# Altium schematic sheet Clock_management.SchDoc: AMC FMC Carrier v4
size 420 x 297 mm; CompanyName: WUT; Organization: WUT ISE; Address1: Warsaw University of Technology; Address2: Nowowiejska 15/19 00-665 Warsaw; Address3: t.przywozki@gmail.com; Revision: 1; SheetNumber: 22; SheetTotal: 29; Project: AMC FMC Carrier v4.0.2; ModifiedBy: M. Biernat; CheckedDate: -; Title2: Clock Management; DivGrp: ISE; Designer: T. Przywozki; ModifiedDate: -; ProjectName: ADC/DAC MEZZANINE
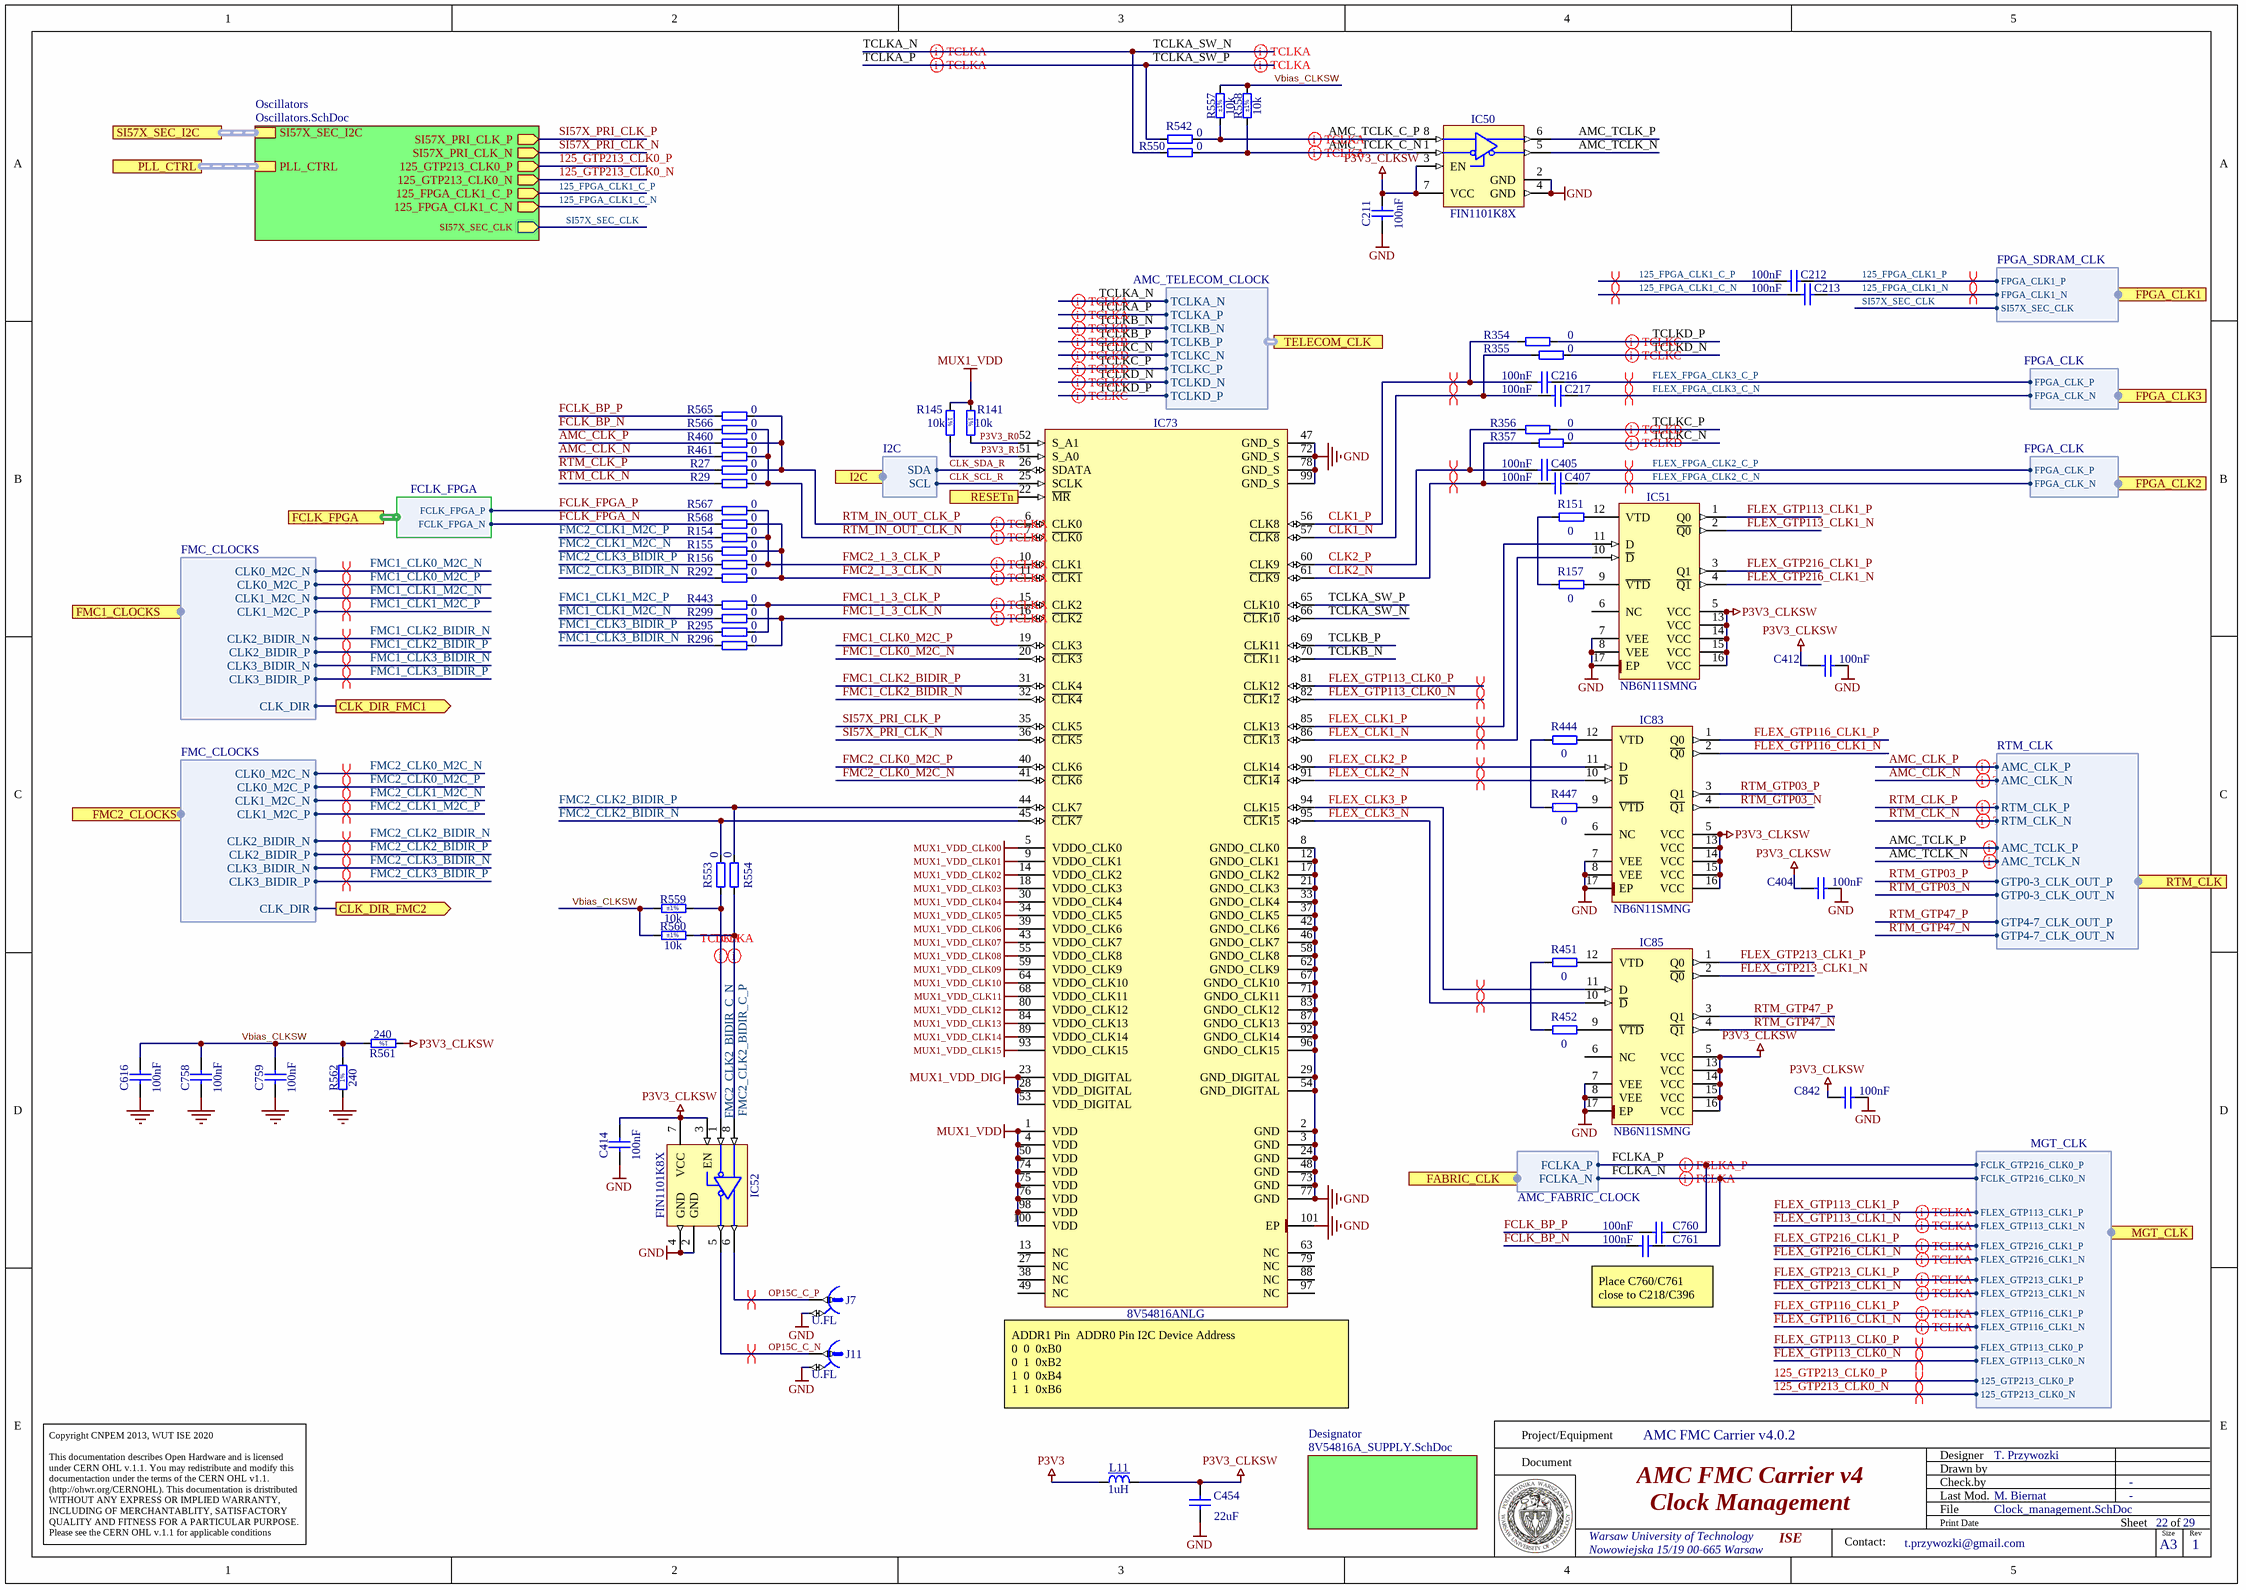
[diagram p0: Clock_management.SchDoc]

## Parts
C211  100nF  [CAPC1005X55N]
C212  100nF  [CAPC0603X33N]
C213  100nF  [CAPC0603X33N]
C216  100nF  [CAPC0603X33N]
C217  100nF  [CAPC0603X33N]
C404  100nF  [CAPC0603X33N]
C405  100nF  [CAPC0603X33N]
C407  100nF  [CAPC0603X33N]
C412  100nF  [CAPC0603X33N]
C414  100nF  [CAPC1005X55N]
C454  22uF  [CAPC3216X180N]
C616  100nF  [CAPC1005X55N]
C758  100nF  [CAPC1005X55N]
C759  100nF  [CAPC1005X55N]
C760  100nF  [CAPC0603X33N]
C761  100nF  [CAPC0603X33N]
C842  100nF  [CAPC0603X33N]
IC50  FIN1101K8X  [SOP50P310X90-8N]
IC51  NB6N11SMNG  [QFN50P300X300X100-17N-S185]
IC52  FIN1101K8X  [SOP50P310X90-8N]
IC73  8V54816ANLG  [QFN40P1200X1200X90-101N-S690]
IC83  NB6N11SMNG  [QFN50P300X300X100-17N-S185]
IC85  NB6N11SMNG  [QFN50P300X300X100-17N-S185]
J7  U.FL  [HIROSE_U.FL-R-SMT-1(10)]
J11  U.FL  [HIROSE_U.FL-R-SMT-1(10)]
L11  1uH  [IND_PANASONIC_ELLVGG]
R27  0  [RESC1005X40N]
R29  0  [RESC1005X40N]
R141  10k  [RESC1005X40N]
R145  10k  [RESC1005X40N]
R151  0  [RESC1005X40N]
R154  0  [RESC1005X40N]
R155  0  [RESC1005X40N]
R156  0  [RESC1005X40N]
R157  0  [RESC1005X40N]
R292  0  [RESC1005X40N]
R295  0  [RESC1005X40N]
R296  0  [RESC1005X40N]
R299  0  [RESC1005X40N]
R354  0  [RESC0603X28N]
R355  0  [RESC0603X28N]
R356  0  [RESC0603X28N]
R357  0  [RESC0603X28N]
R443  0  [RESC1005X40N]
R444  0  [RESC1005X40N]
R447  0  [RESC1005X40N]
R451  0  [RESC1005X40N]
R452  0  [RESC1005X40N]
R460  0  [RESC1005X40N]
R461  0  [RESC1005X40N]
R542  0  [RESC1005X40N]
R550  0  [RESC1005X40N]
R553  0  [RESC1005X40N]
R554  0  [RESC1005X40N]
R557  10k  Tolerance: ±1%  [RESC1005X40N]
R558  10k  Tolerance: ±1%  [RESC1005X40N]
R559  10k  Tolerance: ±1%  [RESC1005X40N]
R560  10k  Tolerance: ±1%  [RESC1005X40N]
R561  240  [RESC1005X40N]
R562  240  [RESC1005X40N]
R565  0  [RESC1005X40N]
R566  0  [RESC1005X40N]
R567  0  [RESC1005X40N]
R568  0  [RESC1005X40N]

## Sub-sheets
Designator = 8V54816A_SUPPLY.SchDoc: no entries
Oscillators = Oscillators.SchDoc: SI57X_PRI_CLK_P (out), SI57X_PRI_CLK_N (out), SI57X_SEC_CLK (out), 125_FPGA_CLK1_C_N (out), 125_FPGA_CLK1_C_P (out), 125_GTP213_CLK0_N (out), 125_GTP213_CLK0_P (out), SI57X_SEC_I2C (harness SI57X_SEC_I2C), PLL_CTRL (harness PLL_CTRL)

## Ports
CLK_DIR_FMC1 (out), CLK_DIR_FMC2 (out), FABRIC_CLK (harness AMC_FABRIC_CLOCK), FCLK_FPGA (harness FCLK_FPGA), FMC1_CLOCKS (harness FMC_CLOCKS), FMC2_CLOCKS (harness FMC_CLOCKS), FPGA_CLK1 (harness FPGA_SDRAM_CLK), FPGA_CLK2 (harness FPGA_CLK), FPGA_CLK3 (harness FPGA_CLK), I2C (harness I2C), MGT_CLK (harness MGT_CLK), PLL_CTRL (harness PLL_CTRL), RESETn (in), RTM_CLK (harness RTM_CLK), SI57X_SEC_I2C (harness SI57X_SEC_I2C), TELECOM_CLK (harness AMC_TELECOM_CLOCK)

## Harnesses
AMC_FABRIC_CLOCK: FCLKA_N, FCLKA_P
AMC_TELECOM_CLOCK: TCLKA_N, TCLKA_P, TCLKB_N, TCLKB_P, TCLKC_N, TCLKC_P, TCLKD_N, TCLKD_P
MGT_CLK: FCLK_GTP216_CLK0_P, FCLK_GTP216_CLK0_N, FLEX_GTP216_CLK1_P, FLEX_GTP216_CLK1_N, FLEX_GTP113_CLK1_P, FLEX_GTP113_CLK1_N, FLEX_GTP213_CLK1_P, FLEX_GTP213_CLK1_N, FLEX_GTP116_CLK1_P, FLEX_GTP116_CLK1_N, FLEX_GTP113_CLK0_P, FLEX_GTP113_CLK0_N, 125_GTP213_CLK0_P, 125_GTP213_CLK0_N
FPGA_SDRAM_CLK: FPGA_CLK1_N, FPGA_CLK1_P, SI57X_SEC_CLK
I2C: SCL, SDA
FMC_CLOCKS: CLK0_M2C_N, CLK0_M2C_P, CLK1_M2C_N, CLK1_M2C_P, CLK_DIR, CLK2_BIDIR_N, CLK2_BIDIR_P, CLK3_BIDIR_N, CLK3_BIDIR_P
FPGA_CLK: FPGA_CLK_N, FPGA_CLK_P
RTM_CLK: GTP0-3_CLK_OUT_P, GTP0-3_CLK_OUT_N, GTP4-7_CLK_OUT_P, GTP4-7_CLK_OUT_N, AMC_TCLK_P, AMC_TCLK_N, RTM_CLK_P, RTM_CLK_N, AMC_CLK_P, AMC_CLK_N
FCLK_FPGA: FCLK_FPGA_N, FCLK_FPGA_P

## Nets
GND: C211.1 C404.1 C412.1 C414.1 C454.1 C616.1 C758.1 C759.1 C842.1 IC50.2(GND) IC50.4(GND) IC51.7(VEE) IC51.8(VEE) IC51.17(EP) IC52.2(GND) IC52.4(GND) IC73.2(GND) IC73.3(GND) IC73.8(GNDO_CLK0) IC73.12(GNDO_CLK1) IC73.17(GNDO_CLK2) IC73.21(GNDO_CLK3) IC73.24(GND) IC73.29(GND_DIGITAL) IC73.33(GNDO_CLK4) IC73.37(GNDO_CLK5) IC73.42(GNDO_CLK6) IC73.46(GNDO_CLK7) IC73.47(GND_S) IC73.48(GND) IC73.54(GND_DIGITAL) IC73.58(GNDO_CLK8) IC73.62(GNDO_CLK9) IC73.67(GNDO_CLK10) IC73.71(GNDO_CLK11) IC73.72(GND_S) IC73.73(GND) IC73.77(GND) IC73.78(GND_S) IC73.83(GNDO_CLK12) IC73.87(GNDO_CLK13) IC73.92(GNDO_CLK14) IC73.96(GNDO_CLK15) IC73.99(GND_S) IC73.101(EP) IC83.7(VEE) IC83.8(VEE) IC83.17(EP) IC85.7(VEE) IC85.8(VEE) IC85.17(EP) J7.2 J11.2 R562.1
MUX1_VDD: IC73.1(VDD) IC73.4(VDD) IC73.50(VDD) IC73.74(VDD) IC73.75(VDD) IC73.76(VDD) IC73.98(VDD) IC73.100(VDD) R141.2 R145.2
MUX1_VDD_CLK00: IC73.5(VDDO_CLK0)
MUX1_VDD_CLK01: IC73.9(VDDO_CLK1)
MUX1_VDD_CLK02: IC73.14(VDDO_CLK2)
MUX1_VDD_CLK03: IC73.18(VDDO_CLK3)
MUX1_VDD_CLK04: IC73.30(VDDO_CLK4)
MUX1_VDD_CLK05: IC73.34(VDDO_CLK5)
MUX1_VDD_CLK06: IC73.39(VDDO_CLK6)
MUX1_VDD_CLK07: IC73.43(VDDO_CLK7)
MUX1_VDD_CLK08: IC73.55(VDDO_CLK8)
MUX1_VDD_CLK09: IC73.59(VDDO_CLK9)
MUX1_VDD_CLK10: IC73.64(VDDO_CLK10)
MUX1_VDD_CLK11: IC73.68(VDDO_CLK11)
MUX1_VDD_CLK12: IC73.80(VDDO_CLK12)
MUX1_VDD_CLK13: IC73.84(VDDO_CLK13)
MUX1_VDD_CLK14: IC73.89(VDDO_CLK14)
MUX1_VDD_CLK15: IC73.93(VDDO_CLK15)
MUX1_VDD_DIG: IC73.23(VDD_DIGITAL) IC73.28(VDD_DIGITAL) IC73.53(VDD_DIGITAL)
P3V3: L11.1
P3V3_CLKSW: C211.2 C404.2 C412.2 C414.2 C454.2 C842.2 IC50.3(EN) IC50.7(VCC) IC51.5(VCC) IC51.13(VCC) IC51.14(VCC) IC51.15(VCC) IC51.16(VCC) IC52.3(EN) IC52.7(VCC) IC83.5(VCC) IC83.13(VCC) IC83.14(VCC) IC83.15(VCC) IC83.16(VCC) IC85.5(VCC) IC85.13(VCC) IC85.14(VCC) IC85.15(VCC) IC85.16(VCC) L11.2 R561.1
125_FPGA_CLK1_C_N: C213.1 ; sheet Oscillators/125_FPGA_CLK1_C_N
125_FPGA_CLK1_C_P: C212.1 ; sheet Oscillators/125_FPGA_CLK1_C_P
125_FPGA_CLK1_N: C213.2 ; port FPGA_CLK1.FPGA_CLK1_N
125_FPGA_CLK1_P: C212.2 ; port FPGA_CLK1.FPGA_CLK1_P
125_GTP213_CLK0_N: sheet Oscillators/125_GTP213_CLK0_N, port MGT_CLK.125_GTP213_CLK0_N
125_GTP213_CLK0_P: sheet Oscillators/125_GTP213_CLK0_P, port MGT_CLK.125_GTP213_CLK0_P
AMC_CLK_N: R461.1 ; port RTM_CLK.AMC_CLK_N
AMC_CLK_P: R460.1 ; port RTM_CLK.AMC_CLK_P
AMC_TCLK_C_N: IC50.1(RIN-) R550.2 R558.1
AMC_TCLK_C_P: IC50.8(RIN+) R542.2 R557.1
AMC_TCLK_N: IC50.5(DOUT-) ; port RTM_CLK.AMC_TCLK_N
AMC_TCLK_P: IC50.6(DOUT+) ; port RTM_CLK.AMC_TCLK_P
CLK1_N: C217.1 IC73.57(~{CLK8}) R355.1
CLK1_P: C216.1 IC73.56(CLK8) R354.1
CLK2_N: C407.1 IC73.61(~{CLK9}) R357.1
CLK2_P: C405.1 IC73.60(CLK9) R356.1
CLK_DIR_FMC1: port CLK_DIR_FMC1, port FMC1_CLOCKS.CLK_DIR
CLK_DIR_FMC2: port CLK_DIR_FMC2, port FMC2_CLOCKS.CLK_DIR
CLK_SCL_R: IC73.25(SCLK) ; port I2C.SCL
CLK_SDA_R: IC73.26(SDATA) ; port I2C.SDA
FCLK_BP_N: C761.1 R566.1
FCLK_BP_P: C760.1 R565.1
FCLK_FPGA_N: R568.1 ; port FCLK_FPGA.FCLK_FPGA_N
FCLK_FPGA_P: R567.1 ; port FCLK_FPGA.FCLK_FPGA_P
FCLKA_N: C761.2 ; port FABRIC_CLK.FCLKA_N, port MGT_CLK.FCLK_GTP216_CLK0_N
FCLKA_P: C760.2 ; port FABRIC_CLK.FCLKA_P, port MGT_CLK.FCLK_GTP216_CLK0_P
FLEX_CLK1_N: IC51.10(~{D}) IC73.86(~{CLK}1~{3})
FLEX_CLK1_P: IC51.11(D) IC73.85(CLK13)
FLEX_CLK2_N: IC73.91(~{CLK}1~{4}) IC83.10(~{D})
FLEX_CLK2_P: IC73.90(CLK14) IC83.11(D)
FLEX_CLK3_N: IC73.95(~{CLK}1~{5}) IC85.10(~{D})
FLEX_CLK3_P: IC73.94(CLK15) IC85.11(D)
FLEX_FPGA_CLK2_C_N: C407.2 ; port FPGA_CLK2.FPGA_CLK_N
FLEX_FPGA_CLK2_C_P: C405.2 ; port FPGA_CLK2.FPGA_CLK_P
FLEX_FPGA_CLK3_C_N: C217.2 ; port FPGA_CLK3.FPGA_CLK_N
FLEX_FPGA_CLK3_C_P: C216.2 ; port FPGA_CLK3.FPGA_CLK_P
FLEX_GTP113_CLK0_N: IC73.82(~{CLK}1~{2}) ; port MGT_CLK.FLEX_GTP113_CLK0_N
FLEX_GTP113_CLK0_P: IC73.81(CLK12) ; port MGT_CLK.FLEX_GTP113_CLK0_P
FLEX_GTP113_CLK1_N: IC51.2(~{Q0}) ; port MGT_CLK.FLEX_GTP113_CLK1_N
FLEX_GTP113_CLK1_P: IC51.1(Q0) ; port MGT_CLK.FLEX_GTP113_CLK1_P
FLEX_GTP116_CLK1_N: IC83.2(~{Q0}) ; port MGT_CLK.FLEX_GTP116_CLK1_N
FLEX_GTP116_CLK1_P: IC83.1(Q0) ; port MGT_CLK.FLEX_GTP116_CLK1_P
FLEX_GTP213_CLK1_N: IC85.2(~{Q0}) ; port MGT_CLK.FLEX_GTP213_CLK1_N
FLEX_GTP213_CLK1_P: IC85.1(Q0) ; port MGT_CLK.FLEX_GTP213_CLK1_P
FLEX_GTP216_CLK1_N: IC51.4(~{Q1}) ; port MGT_CLK.FLEX_GTP216_CLK1_N
FLEX_GTP216_CLK1_P: IC51.3(Q1) ; port MGT_CLK.FLEX_GTP216_CLK1_P
FMC1_1_3_CLK_N: IC73.16(~{CLK2}) R296.2 R299.2
FMC1_1_3_CLK_P: IC73.15(CLK2) R295.2 R443.2
FMC1_CLK0_M2C_N: IC73.20(~{CLK3}) ; port FMC1_CLOCKS.CLK0_M2C_N
FMC1_CLK0_M2C_P: IC73.19(CLK3) ; port FMC1_CLOCKS.CLK0_M2C_P
FMC1_CLK1_M2C_N: R299.1 ; port FMC1_CLOCKS.CLK1_M2C_N
FMC1_CLK1_M2C_P: R443.1 ; port FMC1_CLOCKS.CLK1_M2C_P
FMC1_CLK2_BIDIR_N: IC73.32(~{CLK4}) ; port FMC1_CLOCKS.CLK2_BIDIR_N
FMC1_CLK2_BIDIR_P: IC73.31(CLK4) ; port FMC1_CLOCKS.CLK2_BIDIR_P
FMC1_CLK3_BIDIR_N: R296.1 ; port FMC1_CLOCKS.CLK3_BIDIR_N
FMC1_CLK3_BIDIR_P: R295.1 ; port FMC1_CLOCKS.CLK3_BIDIR_P
FMC2_1_3_CLK_N: IC73.11(~{CLK1}) R155.2 R292.2 R568.2
FMC2_1_3_CLK_P: IC73.10(CLK1) R154.2 R156.2 R567.2
FMC2_CLK0_M2C_N: IC73.41(~{CLK6}) ; port FMC2_CLOCKS.CLK0_M2C_N
FMC2_CLK0_M2C_P: IC73.40(CLK6) ; port FMC2_CLOCKS.CLK0_M2C_P
FMC2_CLK1_M2C_N: R155.1 ; port FMC2_CLOCKS.CLK1_M2C_N
FMC2_CLK1_M2C_P: R154.1 ; port FMC2_CLOCKS.CLK1_M2C_P
FMC2_CLK2_BIDIR_C_N: IC52.1(RIN-) R553.1 R559.2
FMC2_CLK2_BIDIR_C_P: IC52.8(RIN+) R554.1 R560.2
FMC2_CLK2_BIDIR_N: IC73.45(~{CLK7}) R553.2 ; port FMC2_CLOCKS.CLK2_BIDIR_N
FMC2_CLK2_BIDIR_P: IC73.44(CLK7) R554.2 ; port FMC2_CLOCKS.CLK2_BIDIR_P
FMC2_CLK3_BIDIR_N: R292.1 ; port FMC2_CLOCKS.CLK3_BIDIR_N
FMC2_CLK3_BIDIR_P: R156.1 ; port FMC2_CLOCKS.CLK3_BIDIR_P
OP15C_C_N: IC52.5(DOUT-) J11.1
OP15C_C_P: IC52.6(DOUT+) J7.1
P3V3_R0: IC73.52(S_A1) R141.1
P3V3_R1: IC73.51(S_A0) R145.1
RESETn: IC73.22(~{MR}) ; port RESETn
RTM_CLK_N: R29.1 ; port RTM_CLK.RTM_CLK_N
RTM_CLK_P: R27.1 ; port RTM_CLK.RTM_CLK_P
RTM_GTP03_N: IC83.4(~{Q1}) ; port RTM_CLK.GTP0-3_CLK_OUT_N
RTM_GTP03_P: IC83.3(Q1) ; port RTM_CLK.GTP0-3_CLK_OUT_P
RTM_GTP47_N: IC85.4(~{Q1}) ; port RTM_CLK.GTP4-7_CLK_OUT_N
RTM_GTP47_P: IC85.3(Q1) ; port RTM_CLK.GTP4-7_CLK_OUT_P
RTM_IN_OUT_CLK_N: IC73.7(~{CLK0}) R29.2 R461.2 R566.2
RTM_IN_OUT_CLK_P: IC73.6(CLK0) R27.2 R460.2 R565.2
SI57X_PRI_CLK_N: IC73.36(~{CLK5}) ; sheet Oscillators/SI57X_PRI_CLK_N
SI57X_PRI_CLK_P: IC73.35(CLK5) ; sheet Oscillators/SI57X_PRI_CLK_P
SI57X_SEC_CLK: sheet Oscillators/SI57X_SEC_CLK, port FPGA_CLK1.SI57X_SEC_CLK
TCLKA_N: IC73.66(~{CLK}1~{0}) R550.1 ; port TELECOM_CLK.TCLKA_N  [also labelled TCLKA_SW_N]
TCLKA_P: IC73.65(CLK10) R542.1 ; port TELECOM_CLK.TCLKA_P  [also labelled TCLKA_SW_P]
TCLKB_N: IC73.70(~{CLK}11) ; port TELECOM_CLK.TCLKB_N
TCLKB_P: IC73.69(CLK11) ; port TELECOM_CLK.TCLKB_P
TCLKC_N: R357.2 ; port TELECOM_CLK.TCLKC_N
TCLKC_P: R356.2 ; port TELECOM_CLK.TCLKC_P
TCLKD_N: R355.2 ; port TELECOM_CLK.TCLKD_N
TCLKD_P: R354.2 ; port TELECOM_CLK.TCLKD_P
Vbias_CLKSW: C616.2 C758.2 C759.2 R557.2 R558.2 R559.1 R560.1 R561.2 R562.2
NetIC51_9: IC51.9(~{VTD}) R157.2
NetIC51_12: IC51.12(VTD) R151.2
NetIC83_9: IC83.9(~{VTD}) R447.2
NetIC83_12: IC83.12(VTD) R444.2
NetIC85_9: IC85.9(~{VTD}) R452.2
NetIC85_12: IC85.12(VTD) R451.2
NetR151_1: R151.1 R157.1
NetR444_1: R444.1 R447.1
NetR451_1: R451.1 R452.1

Not connected (* = marked no-connect by the designer): IC51 6(NC); IC73 13(NC) 27(NC) 38(NC) 49(NC) 63(NC) 79(NC) 88(NC) 97(NC); IC83 6(NC); IC85 6(NC)

## Buses and harness runs
harness port PLL_CTRL = sheet Oscillators/PLL_CTRL
harness port SI57X_SEC_I2C = sheet Oscillators/SI57X_SEC_I2C

## Layout directives
differential pair: 125_FPGA_CLK1_C_N, 125_FPGA_CLK1_C_P, 125_FPGA_CLK1_N, 125_FPGA_CLK1_P, 125_GTP213_CLK0_N, 125_GTP213_CLK0_P, AMC_CLK_N, AMC_CLK_P, AMC_TCLK_C_N, AMC_TCLK_C_P, AMC_TCLK_N, AMC_TCLK_P, CLK1_N, CLK1_P, CLK2_N, CLK2_P, FCLKA_N, FCLKA_P, FLEX_CLK1_N, FLEX_CLK1_P, FLEX_CLK2_N, FLEX_CLK2_P, FLEX_CLK3_N, FLEX_CLK3_P, FLEX_FPGA_CLK2_C_N, FLEX_FPGA_CLK2_C_P, FLEX_FPGA_CLK3_C_N, FLEX_FPGA_CLK3_C_P, FLEX_GTP113_CLK0_N, FLEX_GTP113_CLK0_P, FLEX_GTP113_CLK1_N, FLEX_GTP113_CLK1_P, FLEX_GTP116_CLK1_N, FLEX_GTP116_CLK1_P, FLEX_GTP213_CLK1_N, FLEX_GTP213_CLK1_P, FLEX_GTP216_CLK1_N, FLEX_GTP216_CLK1_P, FMC1_1_3_CLK_N, FMC1_1_3_CLK_P, FMC1_CLK0_M2C_N, FMC1_CLK0_M2C_P, FMC1_CLK1_M2C_N, FMC1_CLK1_M2C_P, FMC1_CLK2_BIDIR_N, FMC1_CLK2_BIDIR_P, FMC1_CLK3_BIDIR_N, FMC1_CLK3_BIDIR_P, FMC2_1_3_CLK_N, FMC2_1_3_CLK_P, FMC2_CLK0_M2C_N, FMC2_CLK0_M2C_P, FMC2_CLK1_M2C_N, FMC2_CLK1_M2C_P, FMC2_CLK2_BIDIR_C_N, FMC2_CLK2_BIDIR_C_P, FMC2_CLK2_BIDIR_N, FMC2_CLK2_BIDIR_P, FMC2_CLK3_BIDIR_N, FMC2_CLK3_BIDIR_P, OP15C_C_N, OP15C_C_P, RTM_CLK_N, RTM_CLK_P, RTM_IN_OUT_CLK_N, RTM_IN_OUT_CLK_P, TCLKA_N, TCLKA_P, TCLKB_N, TCLKB_P, TCLKC_N, TCLKC_P, TCLKD_N, TCLKD_P

## Notes on the sheet
- Place C760/C761 close to C218/C396
- (near IC73) ADDR1 Pin 	ADDR0 Pin	I2C Device Address
  0		0		0xB0
  0		1		0xB2
  1		0		0xB4
  1		1		0xB6
- Project/Equipment
- Document
- Designer
- Drawn by
- Check.by
- Copyright CNPEM 2013, WUT ISE 2020
  This documentation describes Open Hardware and is licensed under CERN OHL v.1.1. You may redistribute and modify this documentaction under the terms of the CERN OHL v1.1.
  (http://ohwr.org/CERNOHL). This documentation is dristributed WITHOUT ANY EXPRESS OR IMPLIED WARRANTY, INCLUDING OF MERCHANTABLITY, SATISFACTORY QUALITY AND FITNESS FOR A PARTICULAR PURPOSE. Please see the CERN OHL v.1.1 for applicable conditions
- File
- Last Mod.
- Print Date
- Sheet
- Size
- A3
- of
- Rev
- Contact:
- (in symbol R0402_10K_1%_0.0625W_100PPM) 1%
- (in symbol R0402_240R_1%_0.0625W_100PPM) 1%

## Library data of the parts
C211 C414 C616 C758 C759 = CC0402_100NF_16V_10%_X5R: Non-polarised capacitor; Manufacturer: GENERIC; Part Description: SMD Multilayer Chip Ceramic Capacitor; Manufacturer1 Part Number: GRM155R61C104KA88D; Tolerance: ±10%; Voltage: 16V; TC: X5R; Manufacturer Part Number: CC0402_100NF_16V_10%_X5R; Part Number: CC0402_100NF_16V_10%_X5R; Value: 100nF; Component Kind: Standard; Component Type: Standard; Pin Count: 2; Status: None; Case: 0402; Mounted: Yes; Socket: No; SMD: Yes; Sense: No; Manufacturer1 Example: MURATA; Manufacturer1 ComponentHeight: 0.55mm; HelpURL: \\cern.ch\dfs\Applications\Altium\Datasheets\CC0402_X5R_MURATA_GRM.pdf; Author: CERN DEM JLC; CreateDate: 10.12.2013; LatestRevisionDate: 10.12.2013
C212 C213 C216 C217 C404 C405 C407 C412 C760 C761 C842 = CC0201_100NF_6.3V_10%_X5R: Non-polarised capacitor; Part Description: SMD Multilayer Chip Ceramic Capacitor; Manufacturer: GENERIC; Manufacturer1 Part Number: 02016D104KAT2A; Voltage: 6.3V; TC: X5R; Tolerance: ±10%; Table: Capacitors SMD; Part Number: CC0201_100NF_6.3V_10%_X5R; Component Kind: Standard; Component Type: Standard; Pin Count: 2; Value: 100nF; Status: Not Recommended; Manufacturer Part Number: CC0201_100NF_6.3V_10%_X5R; Case: 0201; Mounted: Yes; Socket: No; SMD: Yes; Manufacturer1 Example: AVX; Manufacturer1 ComponentHeight: 0.33mm; HelpURL: \\cern.ch\dfs\Applications\Altium\Datasheets\CC0201_X5R_AVX.pdf; Author: CERN DEM JLC; CreateDate: 2007-12-03; LatestRevisionDate: 2007-12-03
C454 = CC1206_22UF_10V_10%_X7R: Non-polarised capacitor; Part Description: SMD Multilayer Chip Ceramic Capacitor; Manufacturer: GENERIC; Manufacturer1 Part Number: GRM31CR71A226KE15L; Voltage: 10V; TC: X7R; Tolerance: ±10%; Table: Capacitors SMD; Part Number: CC1206_22UF_10V_10%_X7R; Component Kind: Standard; Component Type: Standard; Pin Count: 2; Value: 22uF; Status: Preferred; Manufacturer Part Number: CC1206_22UF_10V_10%_X7R; Case: 1206; Mounted: Yes; Socket: No; SMD: Yes; Manufacturer1 Example: MURATA; Manufacturer1 ComponentHeight: 1.8mm; HelpURL: \\cern.ch\dfs\Applications\Altium\Datasheets\CC1206_X7R_MURATA_GRM-HI-CAP.pdf; Author: CERN DEM JLC; CreateDate: 2010-06-08; LatestRevisionDate: 2010-06-08
IC50 IC52 = FIN1101K8X: LVDS Single Port High Speed Repeater; Manufacturer: FAIRCHILD SEMICONDUCTOR; PressFit: No; Bonding: No; Part Number: FIN1101K8X; Component Kind: Standard; Component Type: Standard; Device: FIN1101K8X; PackageDescription: SOP, 0.50mm Pitch; 8 pin, 2.30mm W X 2.00mm L X 0.90mm H body, PC Medium Density; Part Description: LVDS Single Port High Speed Repeater; Manufacturer Part Number: FIN1101K8X; Pin Count: 8; Case: TSSOP8; Mounted: Yes; Socket: No; SMD: Yes; Sense: No; ComponentHeight: 0.8mm; Author: CERN DEM JLC; HelpURL: \\cern.ch\dfs\Applications\Altium\Datasheets\FIN1101K8X.pdf; CreateDate: 08.11.2016; LatestRevisionDate: 08.11.2016
IC51 IC83 IC85 = NB6N11SMNG: 3.3V 1:2 AnyLevel Input to LVDS Fanout Buffer / Translator; Manufacturer: ON SEMICONDUCTOR; PressFit: No; Bonding: No; Part Number: NB6N11SMNG; Component Kind: Standard; Component Type: Standard; Device: NB6N11SMNG; PackageDescription: QFN, 0.50mm Pitch, Square; 16 Pin, 3.00mm L X 3.00mm W X 1.00mm H body (w/Thermal Tab 1.85 X 1.85mm), IPC Medium Density; Part Description: 3.3V 1:2 AnyLevel Input to LVDS Fanout Buffer / Translator; Manufacturer Part Number: NB6N11SMNG; Pin Count: 17; Case: QFN16; Mounted: Yes; Socket: No; SMD: Yes; Sense: No; ComponentHeight: 1mm; Author: CERN DEM JLC; HelpURL: \\cern.ch\dfs\Applications\Altium\Datasheets\NB6N11SMNG.pdf; CreateDate: 14.05.2013; LatestRevisionDate: 14.05.2013
IC73 = 8V54816ANLG: 16-Port, Bi-directional M-LVDS Clock Cross-Point Switch; Manufacturer: INTEGRATED DEVICE TECHNOLOGY (IDT); PressFit: No; Bonding: No; Part Number: 8V54816ANLG; Component Kind: Standard; Component Type: Standard; Device: 8V54816ANLG; PackageDescription: QFN, 0.40mm Pitch, Square; 100 Pin, 12.0mm L X 12.0mm W X 0.90mm H body (w/Thermal Tab 6.90 X 6.90mm), IPC Medium Density; Status: Not Recommended; Part Description: 16-Port, Bi-directional M-LVDS Clock Cross-Point Switch; Manufacturer Part Number: 8V54816ANLG; Pin Count: 101; Case: QFN100; Mounted: Yes; Socket: No; SMD: Yes; Sense: No; ComponentHeight: 0.9mm; Author: CERN DEM MR; HelpURL: \\cern.ch\dfs\Applications\Altium\Datasheets\8V54816ANLG.pdf; CreateDate: 02.06.2016; LatestRevisionDate: 30.03.2017
J7 J11 = HIROSE_U.FL-R-SMT-1(10): Part Description: Up to 6GHz Ultra Small Surface Mount Male Coaxial Connectors U.FL Series; Manufacturer: HIROSE (HRS); PressFit: No; Part Number: HIROSE_U.FL-R-SMT-1(10); Component Kind: Standard; Component Type: Standard; Pin Count: 2; Family: U.FL; Mounted: Yes; Socket: No; SMD: Yes; Sense: No; Status: None; Manufacturer Part Number: U.FL-R-SMT-1(10); ComponentHeight: 1.25mm; HelpURL: \\cern.ch\dfs\Applications\Altium\Datasheets\HIROSE_U.FL-R-SMT-1(10).pdf; Author: CERN DEM JLC; CreateDate: 24.03.2010; LatestRevisionDate: 24.03.2010
L11 = IND_1UH_30%_PANASONIC_ELLVGG1R0N: Inductor With Core; Part Description: Wire Wound SMD Power Inductor, G Series, Type ELLVGG; Power: 1.8A; Resistance: 0.052R; Tolerance: ±30%; Part Number: IND_1UH_30%_PANASONIC_ELLVGG1R0N; Component Kind: Standard; Component Type: Standard; Pin Count: 2; Value: 1uH; Status: None; Manufacturer: PANASONIC; Manufacturer Part Number: ELLVGG1R0N; Mounted: Yes; Socket: No; SMD: Yes; Sense: No; ComponentHeight: 1.5mm; HelpURL: \\cern.ch\dfs\Applications\Altium\Datasheets\IND_PANASONIC_ELLVGG.pdf; Author: CERN DEM JLC; CreateDate: 09.11.2016; LatestRevisionDate: 09.11.2016
R27 R29 R151 R154-R157 R292 R295 R296 R299 R443 R444 R447 R451 R452 R460 R461 R542 R550 R553 R554 R565-R568 = R0402_0R_JUMPER: Resistor; Part Description: 1A (0.05R Max DC Resistance) Zero Ohm Jumper; Manufacturer: GENERIC; Manufacturer1 Part Number: 232270591001L; PressFit: No; Part Number: R0402_0R_JUMPER; Component Kind: Standard; Component Type: Standard; Pin Count: 2; Value: 0; Status: Not Recommended; Manufacturer Part Number: R0402_0R_JUMPER; Case: 0402; Mounted: Yes; Sense: No; Socket: No; SMD: Yes; Manufacturer1 Example: YAGEO PHYCOMP; Manufacturer1 ComponentHeight: 0.4mm; HelpURL: \\cern.ch\dfs\Applications\Altium\Datasheets\R0402_Phycomp_RC0402.pdf; Author: CERN DEM JLC; CreateDate: 03.12.2007; LatestRevisionDate: 17.10.2012
R141 R145 = R0402_10K_1%_0.0625W_100PPM: Resistor - 1%; Part Description: General Purpose Thick Film Chip Resistor; Manufacturer: GENERIC; Manufacturer1 Part Number: 232270671003L; TC: ±100ppm/°C; Table: Resistors SMD; Part Number: R0402_10K_1%_0.0625W_100PPM; Component Kind: Standard; Component Type: Standard; Pin Count: 2; Value: 10k; Status: Not recommended; Power: 0.0625W; Tolerance: ±1%; Manufacturer Part Number: R0402_10K_1%_0.0625W_100PPM; Case: 0402; Mounted: Yes; Socket: No; SMD: Yes; Manufacturer1 Example: YAGEO PHYCOMP; Manufacturer1 ComponentHeight: 0.4mm; HelpURL: \\cern.ch\dfs\Applications\Altium\Datasheets\R0402_Phycomp_RC0402.pdf; Author: CERN DEM JLC; CreateDate: 2007-12-03; LatestRevisionDate: 2012-10-17
R354-R357 = R0201_0R_JUMPER: Resistor; Part Description: 1A (0.05R Max DC Resistance) Zero Ohm Jumper; Manufacturer: GENERIC; Manufacturer1 Part Number: CRCW02010000Z0ED; PressFit: No; Part Number: R0201_0R_JUMPER; Component Kind: Standard; Component Type: Standard; Pin Count: 2; Value: 0; Status: Not Recommended; Manufacturer Part Number: R0201_0R_JUMPER; Case: 0201; Mounted: Yes; Sense: No; Socket: No; SMD: Yes; Manufacturer1 Example: VISHAY; Manufacturer1 ComponentHeight: 0.27mm; HelpURL: \\cern.ch\dfs\Applications\Altium\Datasheets\R0201_VISHAY_CRCW e3.pdf; Author: CERN DEM JLC; CreateDate: 19.11.2014; LatestRevisionDate: 08.01.2015
R557-R560 = R0402_10K_1%_0.0625W_100PPM: Resistor - 1%; Part Description: General Purpose Thick Film Chip Resistor; Manufacturer: GENERIC; Manufacturer1 Part Number: 232270671003L; TC: ±100ppm/°C; PressFit: No; Part Number: R0402_10K_1%_0.0625W_100PPM; Component Kind: Standard; Component Type: Standard; Pin Count: 2; Value: 10k; Status: Not Recommended; Power: 0.0625W; Manufacturer Part Number: R0402_10K_1%_0.0625W_100PPM; Case: 0402; Mounted: Yes; Sense: No; Socket: No; SMD: Yes; Manufacturer1 Example: YAGEO PHYCOMP; Manufacturer1 ComponentHeight: 0.4mm; HelpURL: \\cern.ch\dfs\Applications\Altium\Datasheets\R0402_Phycomp_RC0402.pdf; Author: CERN DEM JLC; CreateDate: 03.12.2007; LatestRevisionDate: 17.10.2012
R561 R562 = R0402_240R_1%_0.0625W_100PPM: Resistor - 1%; Manufacturer: GENERIC; Part Description: General Purpose Thick Film Chip Resistor; Manufacturer1 Part Number: 232270672401L; TC: ±100ppm/°C; PressFit: No; Manufacturer Part Number: R0402_240R_1%_0.0625W_100PPM; Part Number: R0402_240R_1%_0.0625W_100PPM; Tolerance: ±1%; Value: 240; Component Kind: Standard; Component Type: Standard; Pin Count: 2; Status: Not Recommended; Power: 0.0625W; Case: 0402; Mounted: Yes; Sense: No; Socket: No; SMD: Yes; Manufacturer1 Example: YAGEO PHYCOMP; Manufacturer1 ComponentHeight: 0.4mm; HelpURL: \\cern.ch\dfs\Applications\Altium\Datasheets\R0402_Phycomp_RC0402.pdf; Author: CERN DEM JLC; CreateDate: 03.12.2007; LatestRevisionDate: 17.10.2012